# Altium schematic sheet Telemetry_AnalogSensors_PTC08_Shifter.SchDoc
size A
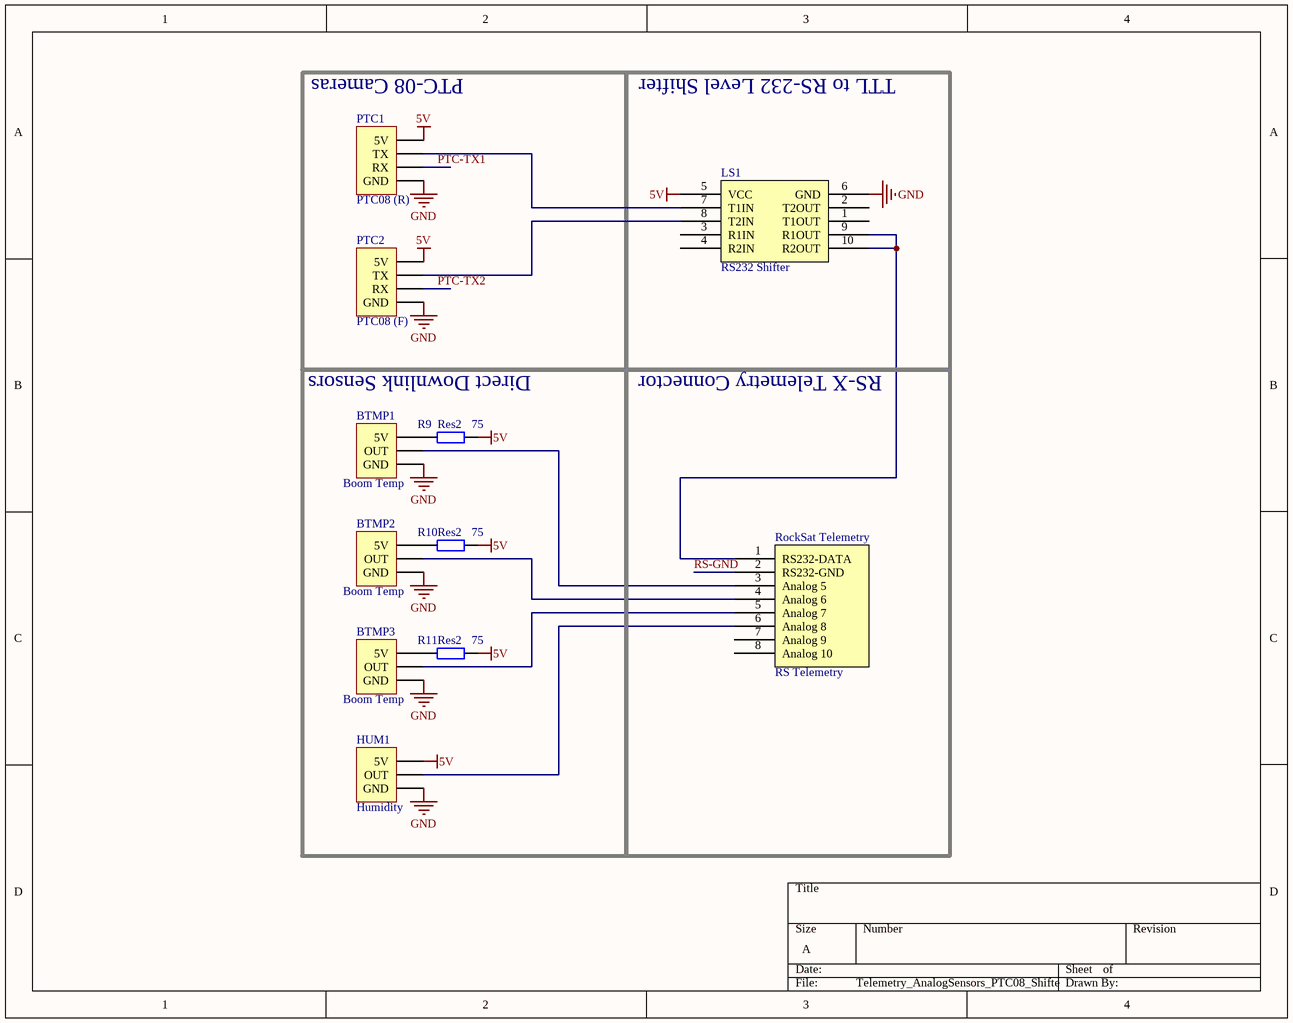
[diagram p0: Telemetry_AnalogSensors_PTC08_Shifter.SchDoc]

## Parts
BTMP1  Boom Temp  [HDR1X3]
BTMP2  Boom Temp  [HDR1X3]
BTMP3  Boom Temp  [HDR1X3]
HUM1  Humidity  [HDR1X3]
LS1  RS232 Shifter
PTC1  PTC08 (R)  [HDR1X4]
PTC2  PTC08 (F)  [HDR1X4]
R9  Res2  value 75  [AXIAL-0.4]
R10  Res2  value 75  [AXIAL-0.4]
R11  Res2  value 75  [AXIAL-0.4]
RockSat_Telemetry  RS Telemetry

## Blocks framed on the sheet
Direct Downlink Sensors: BTMP1-BTMP3 HUM1 R9-R11
RS-X Telemetry Connector: RockSat_Telemetry

## Nets
5V: HUM1.1(5V) LS1.5(VCC) PTC1.1(5V) PTC2.1(5V) R9.1 R10.1 R11.1
GND: BTMP1.3(GND) BTMP2.3(GND) BTMP3.3(GND) HUM1.3(GND) LS1.6(GND) PTC1.4(GND) PTC2.4(GND)
PTC-TX1: PTC1.3(RX)
PTC-TX2: PTC2.3(RX)
RS-GND: RockSat_Telemetry.2(RS232-GND)
NetBTMP1_1: BTMP1.1(5V) R9.2
NetBTMP1_2: BTMP1.2(OUT) RockSat_Telemetry.3(Analog_5)
NetBTMP2_1: BTMP2.1(5V) R10.2
NetBTMP2_2: BTMP2.2(OUT) RockSat_Telemetry.4(Analog_6)
NetBTMP3_1: BTMP3.1(5V) R11.2
NetBTMP3_2: BTMP3.2(OUT) RockSat_Telemetry.5(Analog_7)
NetHUM1_2: HUM1.2(OUT) RockSat_Telemetry.6(Analog_8)
NetLS1_7: LS1.7(T1IN) PTC1.2(TX)
NetLS1_8: LS1.8(T2IN) PTC2.2(TX)
NetLS1_9: LS1.9(R1OUT) LS1.10(R2OUT) RockSat_Telemetry.1(RS232-DATA)

Not connected (* = marked no-connect by the designer): LS1 1(T1OUT) 2(T2OUT) 3(R1IN) 4(R2IN); RockSat_Telemetry 7(Analog_9) 8(Analog_10)

## Notes on the sheet
- (near PTC1) PTC-08 Cameras
- TTL to RS-232 Level Shifter

## Library data of the parts
BTMP1-BTMP3 HUM1 = Header 3: Header, 3-Pin; LatestRevisionDate: 17-Jul-2002; LatestRevisionNote: Re-released for DXP Platform.; Publisher: Altium Limited
LS1 RockSat_Telemetry = Component_1
PTC1 PTC2 = Header 4: Header, 4-Pin; LatestRevisionDate: 17-Jul-2002; LatestRevisionNote: Re-released for DXP Platform.; Publisher: Altium Limited
R9-R11 = Res2: Resistor; Published: 8-Jun-2000; LatestRevisionDate: 17-Jul-2002; LatestRevisionNote: Re-released for DXP Platform.; PackageReference: AXIAL-0.4; Publisher: Altium Limited; PackageDescription: Axial Device, Thru-Hole; 2 Leads; 0.4 in Pin Spacing